# EAGLE design test (EAGLE 6.4)
GCN: 1.0; PCBNAME: Virtjoule-Sense; PROJECT: Virtjoule-Sense
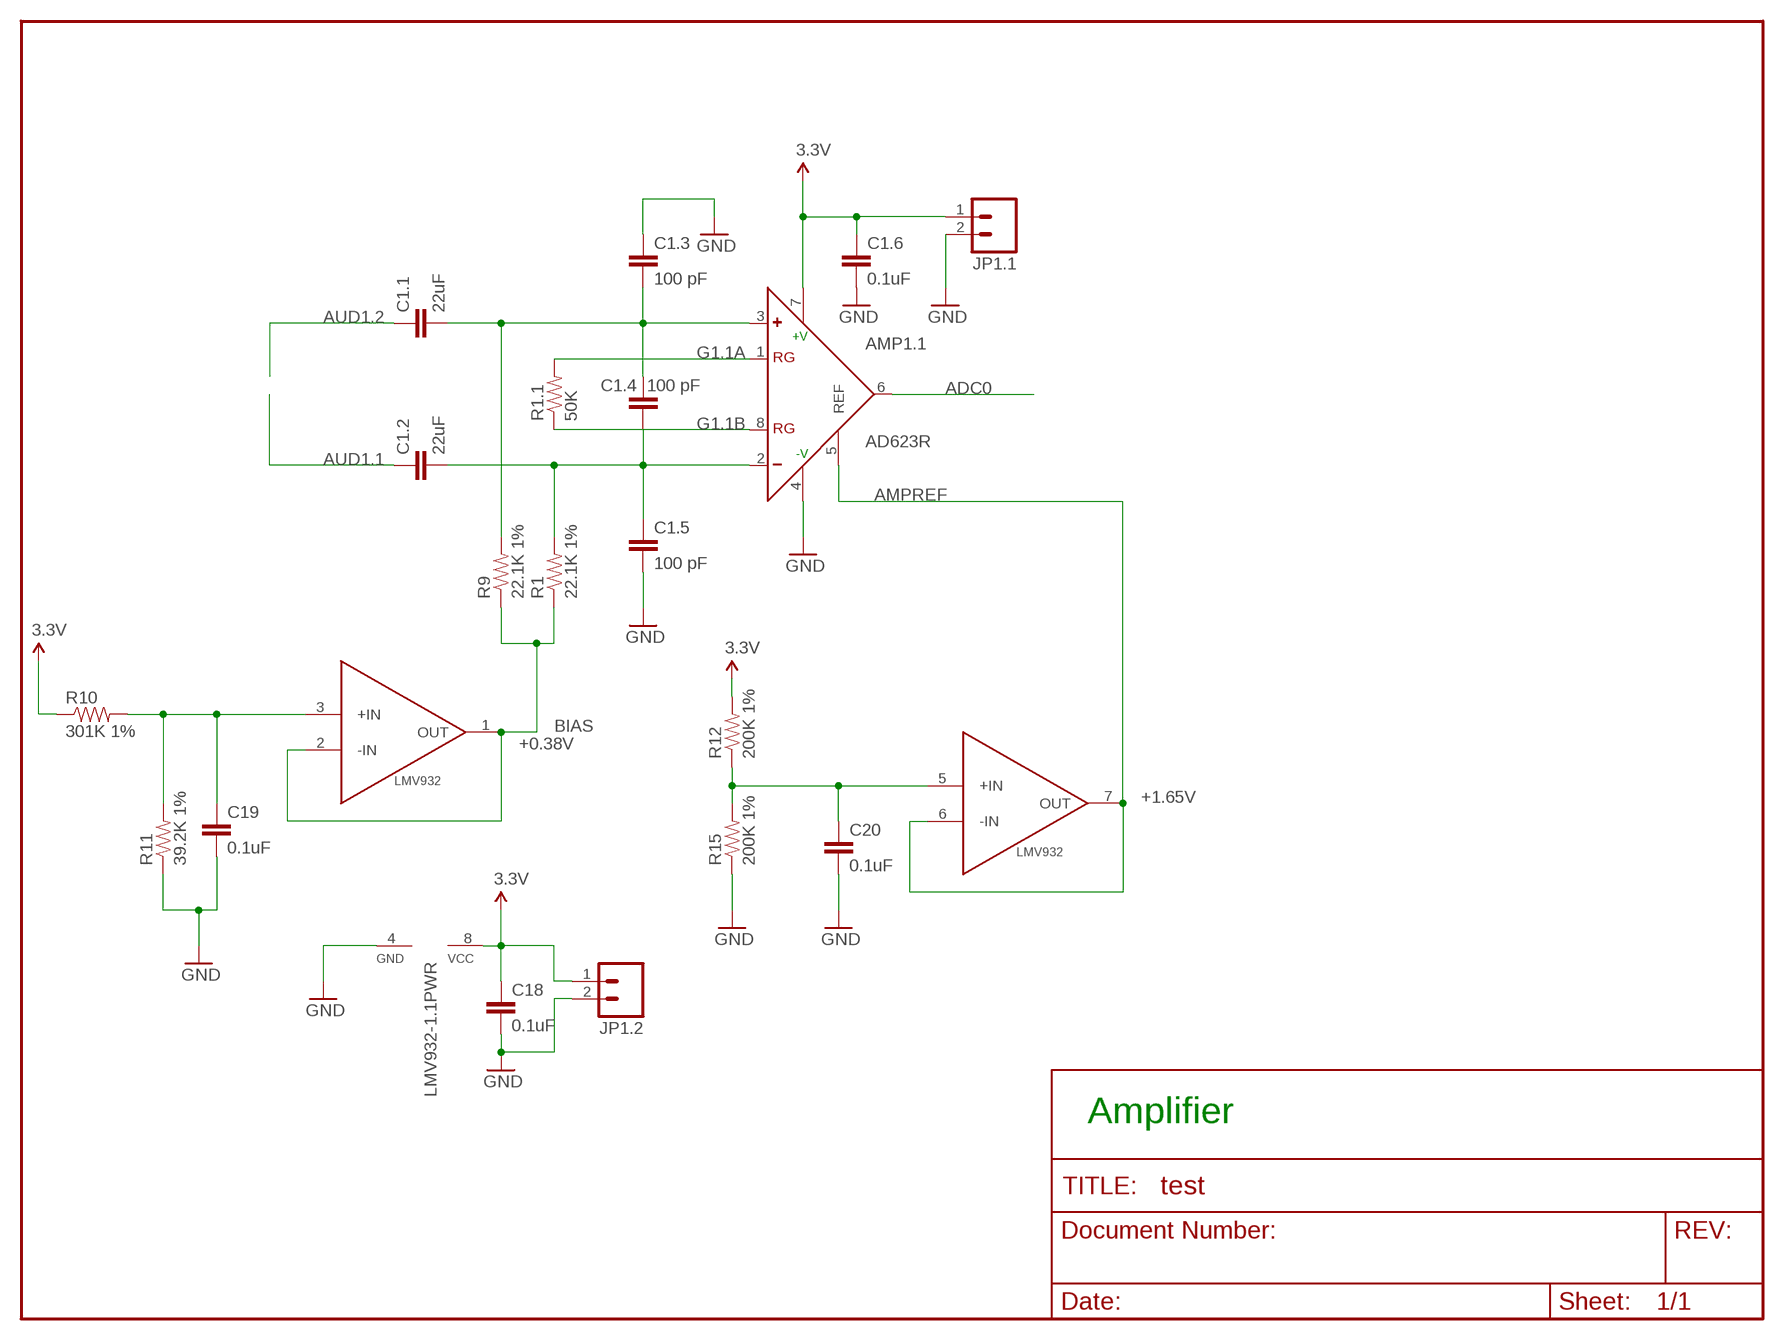
[diagram p0: schematic, sheet 1]

## Parts
AMP1.1  AD623R  [SO8]
C1.1  22uF  CAP1206  [1206]
C1.2  22uF  CAP1206  [1206]
C1.3  100 pF  CAP0805  [0805]
C1.4  100 pF  CAP0805  [0805]
C1.5  100 pF  CAP0805  [0805]
C1.6  0.1uF  CAP0805  [0805]
C18  0.1uF  CAP0805  [0805]
C19  0.1uF  CAP0805  [0805]
C20  0.1uF  CAP0805  [0805]
JP1.1  M021X02_NO_SILK  [1X02_NO_SILK]
JP1.2  M021X02_NO_SILK  [1X02_NO_SILK]
LMV932-1.1  LMV932  [SOIC8]
R1  22.1K 1%  RESISTOR0805-RES  [0805]
R1.1  50K  RESISTOR0805-RES  [0805]
R9  22.1K 1%  RESISTOR0805-RES  [0805]
R10  301K 1%  RESISTOR0805-RES  [0805]
R11  39.2K 1%  RESISTOR0805-RES  [0805]
R12  200K 1%  RESISTOR0805-RES  [0805]
R15  200K 1%  RESISTOR0805-RES  [0805]

## Nets
3.3V: AMP1.1.7(+V) C1.6.1 C18.1 JP1.1.1 JP1.2.1 LMV932-1.1.8(PWR:VCC) R10.1 R12.2
ADC0: AMP1.1.6(OUT)
AMPREF: AMP1.1.5(REF) LMV932-1.1.6(B:-IN) LMV932-1.1.7(B:OUT)
AUD1.1: C1.2.1
AUD1.2: C1.1.1
BIAS: LMV932-1.1.1(A:OUT) LMV932-1.1.2(A:-IN) R1.1 R9.1
G1.1A: AMP1.1.1(RG) R1.1.2
G1.1B: AMP1.1.8(RG) R1.1.1
GND: AMP1.1.4(-V) C1.3.1 C1.5.2 C1.6.2 C18.2 C19.2 C20.2 JP1.1.2 JP1.2.2 LMV932-1.1.4(PWR:GND) R11.1 R15.1
N$4: AMP1.1.2(-) C1.2.2 C1.4.2 C1.5.1 R1.2
N$5: AMP1.1.3(+) C1.1.2 C1.3.2 C1.4.1 R9.2
N$6: C19.1 LMV932-1.1.3(A:+IN) R10.2 R11.2
N$8: C20.1 LMV932-1.1.5(B:+IN) R12.1 R15.2

## Notes on the sheet
- +0.38V
- +1.65V
- Amplifier

## Library data of the parts
AMP1.1 = analog-devices:AD623: Single-Supply, Rail-to-Rail, Low Cost Instrumentation Amplifier Source: http://www.analog.com/static/imported-files/data_sheets/AD623.pdf; DIGIKEY: AD623ARZ-ND; MPN: AD623ARZ.; OC_FARNELL: 9426213; OC_NEWARK: 31M4186; SOURCE1: DIGIKEY
C1.1 C1.2 = SparkFun:CAP: Capacitor Standard 0603 ceramic capacitor, and 0.1" leaded capacitor.; DIGIKEY: 399-3229-1-ND
C1.3-C1.6 C18-C20 = SparkFun:CAP: Capacitor Standard 0603 ceramic capacitor, and 0.1" leaded capacitor.
JP1.1 JP1.2 = SparkFun:M02: Header 2 Standard 2-pin 0.1" header. Use with straight break away headers (SKU : PRT-00116), right angle break away headers (PRT-00553), swiss pins (PRT-00743), machine pins (PRT-00117), and female headers (PRT-00115). Molex polarized connector foot print use with SKU : PRT-08233 with associated crimp pins and housings.
LMV932-1.1 = virtjoule:LMV932
R1 R9-R12 R15 = SparkFun:RESISTOR: Resistor Basic schematic elements and footprints for 0603, 1206, and PTH resistors.
R1.1 = SparkFun-Passives:RESISTOR: Resistor Basic schematic elements and footprints for 0603, 1206, and PTH resistors.

## Board
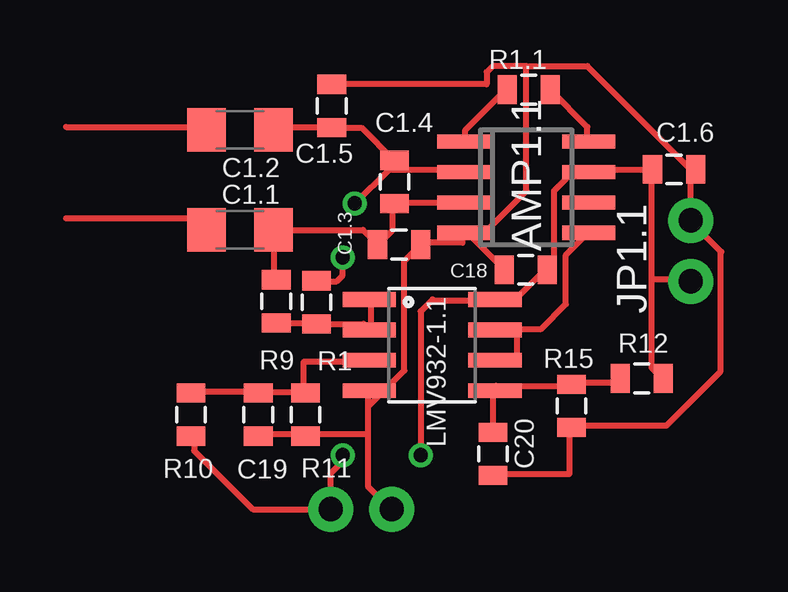
[diagram p1: board, top side]
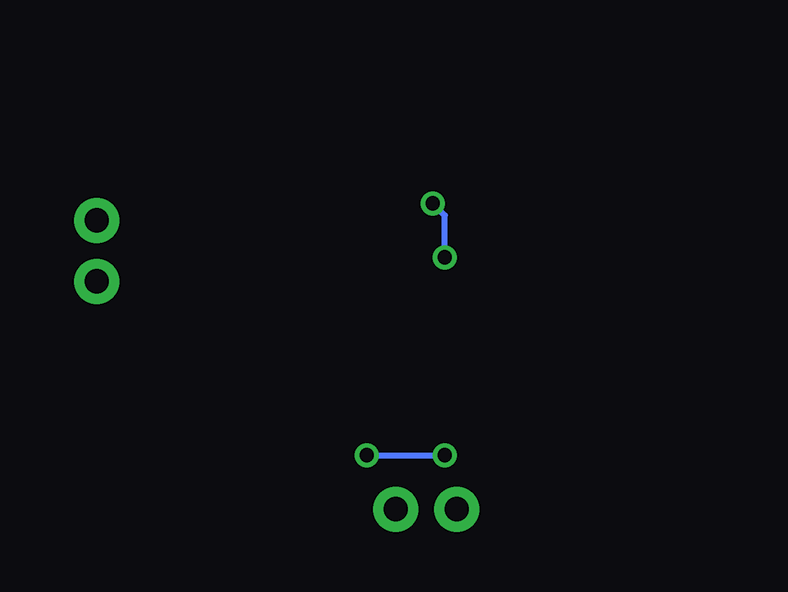
[diagram p2: board, bottom side, seen from below]

No outline drawn. Coordinates in mm, seen from the top.
Copper layers (1*16): Top 0.035mm / dielectric 1.5mm / Bottom 0.035mm
Design rules "default": minimum track width 10mil, minimum drill 24mil, track to track 8mil, track to pad 8mil, pad to pad 8mil, via to via 8mil, smd to smd 8mil, copper to edge 40mil, drill to drill 8mil, minimum pad ring 10mil, minimum via ring 8mil, stop-mask expansion 4mil, vias tented up to drill 0mil, thermal gap 10mil

### Footprints (pad centres in the part's own frame; a part is rotated, then mirrored left to right if it is on the bottom)
SO8 = smd 0.6 x 2.2: 1 -1.905,-2.6; 2 -0.635,-2.6; 3 0.635,-2.6; 4 1.905,-2.6; 5 1.905,2.6; 6 0.635,2.6; 7 -0.635,2.6; 8 -1.905,2.6
1206 = smd 1.6 x 1.8: 1 -1.4,0; 2 1.4,0
0805 = smd 0.8 x 1.2: 1 -0.9,0; 2 0.9,0
1X02_NO_SILK = drill 1.016 pad 1.88: 1 0,0; 2 2.54,0
SOIC8 = smd 0.61 x 2.21: 1 -1.905,-2.616; 2 -0.635,-2.616; 3 0.635,-2.616; 4 1.905,-2.616; 5 1.905,2.616; 6 0.635,2.616; 7 -0.635,2.616; 8 -1.905,2.616

### Placement (x,y rotation side)
AMP1.1  25.4,33.42 270 top
C1.1  13.47,31.65 0 top
C1.2  13.47,35.82 0 top
C1.3  20.1,31.04 180 top
C1.4  19.91,33.64 90 top
C1.5  17.29,36.81 90 top
C1.6  31.55,34.17 0 top
C18  25.37,29.98 180 top
C19  14.23,23.94 270 top
C20  24.01,22.31 270 top
JP1.1  32.25,29.5 90 top
JP1.2  17.25,20 0 top
LMV932-1.1  21.48,26.84 270 top
R1  16.66,28.63 90 top
R1.1  25.5,37.5 180 top
R9  14.98,28.67 90 top
R10  11.43,23.94 90 top
R11  16.2,23.94 90 top
R12  30.21,25.45 0 top
R15  27.28,24.31 90 top

### Tracks (layer width: path | path; a pad name or v marks a point on that pad's centre or on a via)
3.3V  (via drill 0.6)
  Top 0.254: 30.61,29.59 30.61,34.04 C1.6.1 30.61,34.16 28.07,34.16 AMP1.1.7 27.94,34.04 27.3,34.04 26.54,33.27 26.54,30.35 26.29,30.1 C18.1 26.16,29.97 25.02,28.83 24.13,28.83 LMV932-1.1.8 24,28.7 21.5,28.7 | 30.61,29.59 30.61,25.91 30.99,25.53 R12.2 31.11,25.4 | 11.43,22.99 R10.1 11.56,22.99 11.56,22.44 14,20 JP1.2.1 | 30.61,29.59 32.13,29.59 JP1.1.1 | 17.14,20.07 JP1.2.1 | 21.46,28.7 21.5,28.7 | 17.27,19.94 JP1.2.1 | JP1.2.1 17.25,21.5 17.75,22 v17.75,22.25 | v21,22.25 21,28.25 21.5,28.75 21.5,28.7
  Bottom 0.254: v21,22.25 v17.75,22.25
AMPREF
  Top 0.254: AMP1.1.5 27.94,31.5 27.05,30.61 27.05,28.55 26,27.5 25,27.5 | 24.13,26.29 LMV932-1.1.6 25,26.21 25,27.5 | LMV932-1.1.7 24.13,27.43 24.13,27.5 25,27.5
AUD1.1
  Top 0.254: 6.22,35.94 12.06,35.94 C1.2.1
AUD1.2
  Top 0.254: 6.22,32.13 12.06,32.13 C1.1.1
BIAS
  Top 0.254: LMV932-1.1.1 18.92,28.7 18.92,27.56 LMV932-1.1.2 18.61,27.73 R1.1 16.62,27.77 R9.1
G1.1A
  Top 0.254: R1.1.2 24.51,37.47 22.86,35.81 22.86,35.43 AMP1.1.1
G1.1B
  Top 0.254: R1.1.1 26.42,37.47 27.94,35.94 27.94,35.43 AMP1.1.8
GND
  Top 0.254: C20.2 24.13,21.46 27.18,21.46 27.18,23.37 R15.1 27.3,23.5 31.25,23.5 33.5,25.75 33.5,30.71 33.53,30.73 32.26,32 JP1.1.2 32.26,32.13 32.26,34.04 32.38,34.16 C1.6.2 32.26,34.16 27.94,38.48 25.4,38.48 | C18.2 24.38,30.1 22.86,31.62 AMP1.1.4 | AMP1.1.4 22.73,31.5 22.73,31.11 21.08,31.11 C1.3.1 20.95,30.99 20.32,30.35 20.32,25.78 18.8,24.26 | 25.4,38.48 24,38.48 23.75,38.23 23.75,37.72 17.4,37.72 C1.5.2 | 25.4,38.48 25.4,33.27 23.37,31.24 AMP1.1.4 | C19.2 14.35,23.11 16.13,23.11 R11.1 16.26,23.11 18.8,23.11 | 18.8,24.26 18.8,24.89 LMV932-1.1.4 | 18.8,24.26 18.8,23.11 | 18.8,23.11 18.8,20.95 19.68,20.07 JP1.2.2
N$4  (via drill 0.6)
  Top 0.254: C1.2.2 14.99,35.94 17.27,35.94 C1.5.1 18.54,35.91 C1.4.2 | 19.68,34.16 22.73,34.16 AMP1.1.2 | 19.68,34.16 C1.4.2 | v17.75,30.5 17.75,29.75 17.5,29.5 16.75,29.5 R1.2 | 19.75,34.5 C1.4.2 | 19.68,34.16 v18.25,32.75
  Bottom 0.254: v18.25,32.75 17.75,32.25 v17.75,30.5
N$5
  Top 0.254: C1.3.2 19.3,31.11 19.81,31.62 19.81,32.64 C1.4.1 19.94,32.77 22.73,32.77 AMP1.1.3 | 19.18,30.99 C1.3.2 | C1.3.2 18.59,31.65 C1.1.2 14.87,29.67 R9.2
N$6
  Top 0.254: R10.2 11.43,24.89 14.22,24.89 C19.1 14.35,24.89 16.13,24.89 R11.2 16.13,25.02 16.13,26.16 18.8,26.16 LMV932-1.1.3
N$8
  Top 0.254: R12.1 29.21,25.4 29.21,25.27 27.3,25.27 R15.2 27.18,25.15 24.13,25.15 24.13,25.02 LMV932-1.1.5 24,24.89 24,23.24 C20.1